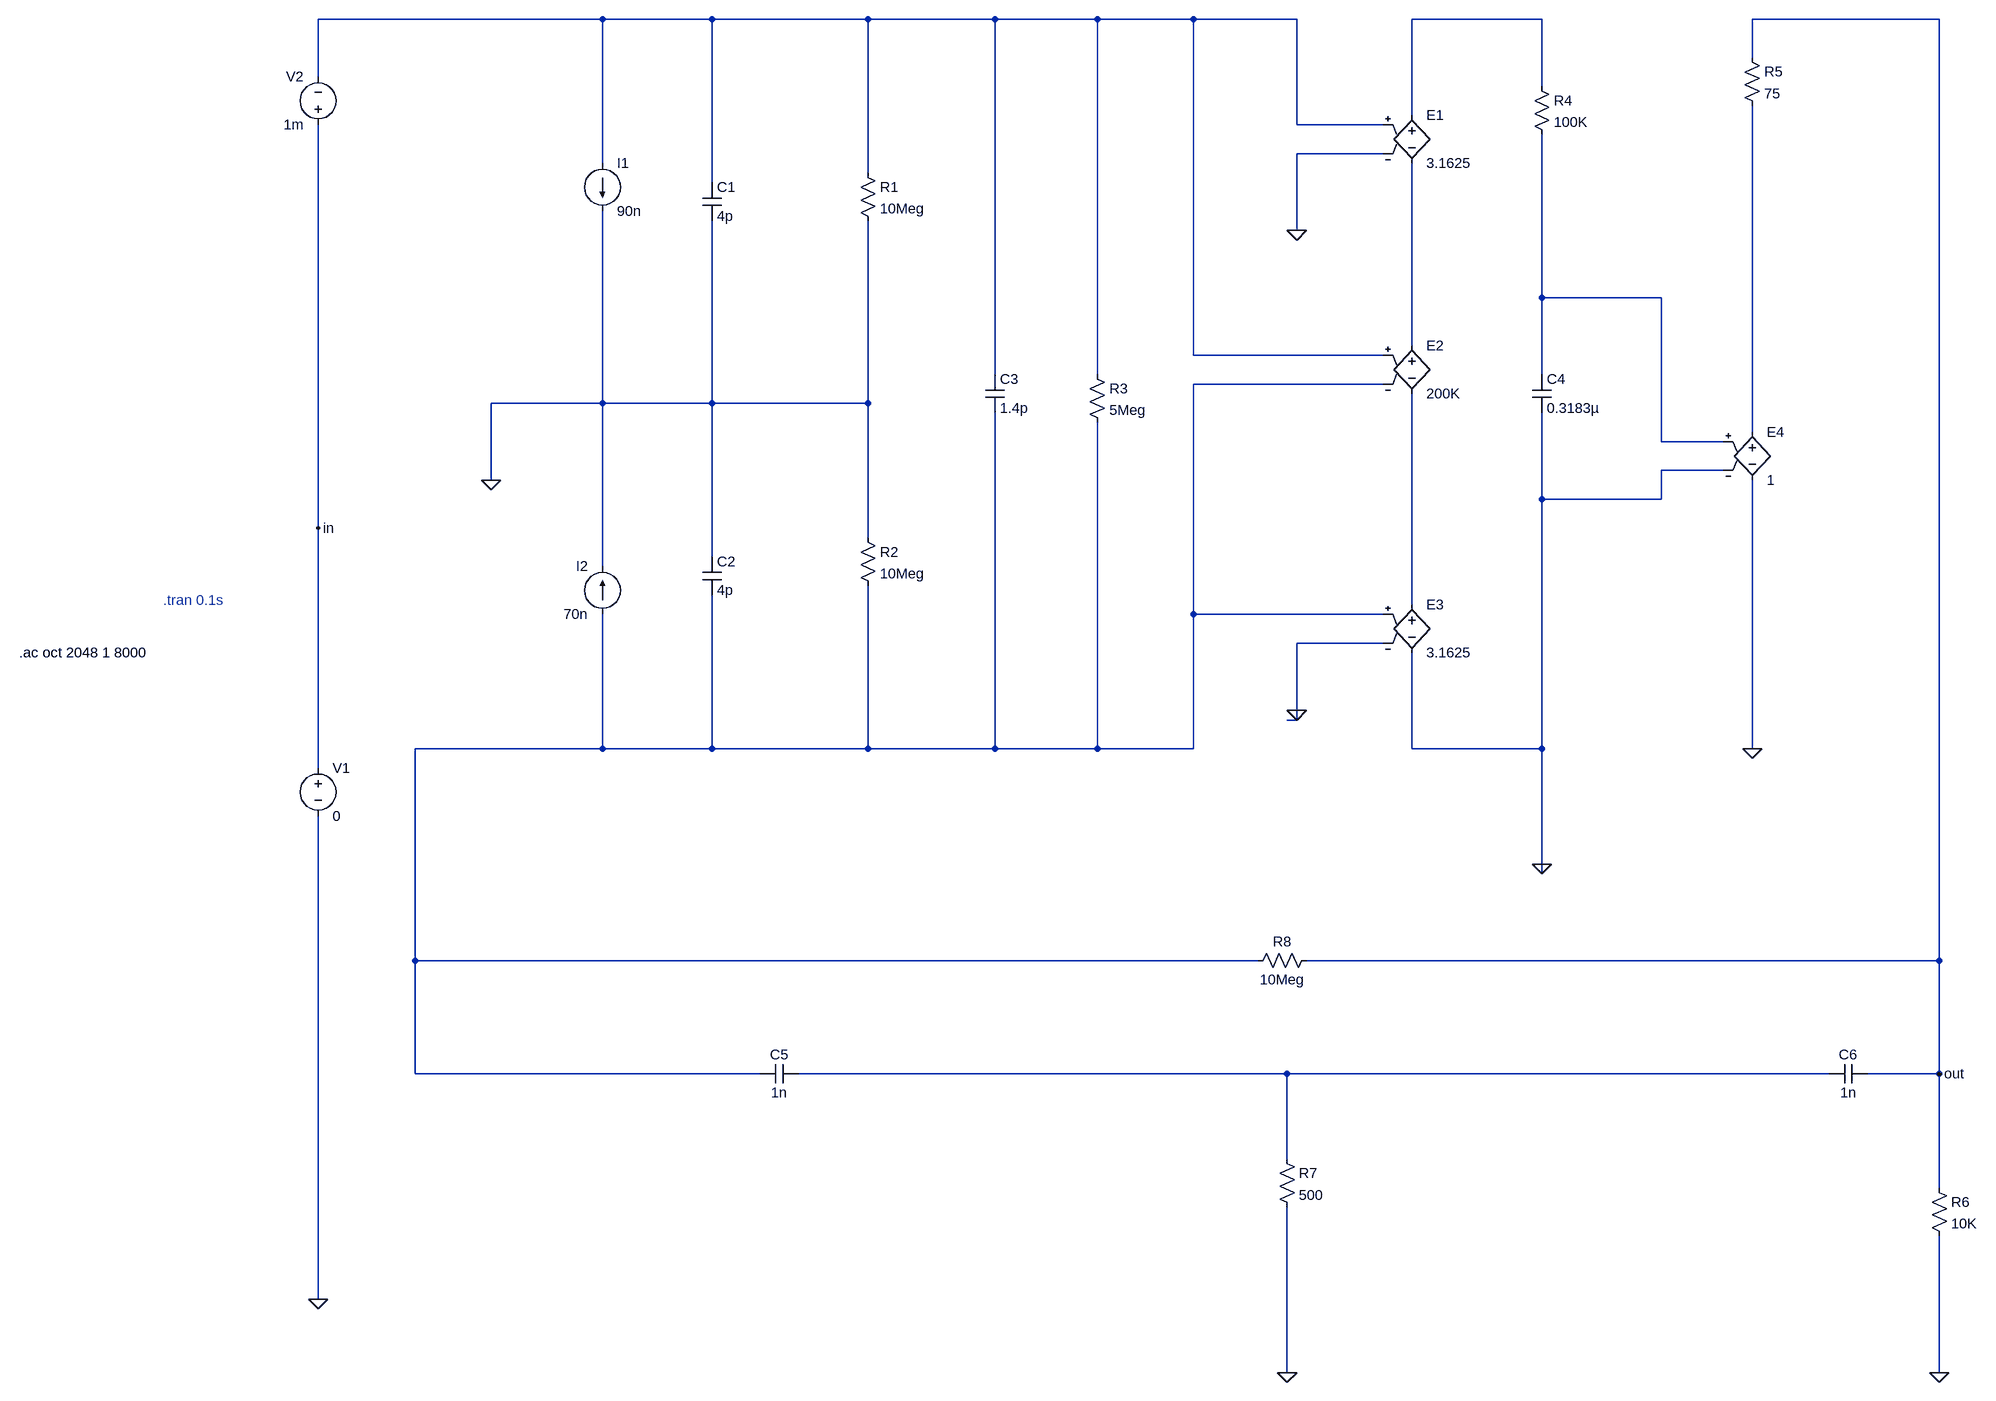
[diagram p0: schematic opamp_macromodel.asc]
opamp_macromodel.asc, the LTspice schematic file:
Version 4
SHEET 1 5460 1888
WIRE 880 -992 -64 -992
WIRE 1296 -992 880 -992
WIRE 1696 -992 1296 -992
WIRE 2016 -992 1696 -992
WIRE 2320 -992 2016 -992
WIRE 2480 -992 2320 -992
WIRE 2704 -992 2480 -992
WIRE 3296 -992 2896 -992
WIRE 5392 -992 3920 -992
WIRE 3920 -928 3920 -992
WIRE -64 -896 -64 -992
WIRE 3296 -880 3296 -992
WIRE 2896 -832 2896 -992
WIRE 2704 -816 2704 -992
WIRE 2848 -816 2704 -816
WIRE 2848 -768 2704 -768
WIRE 880 -752 880 -992
WIRE 1696 -736 1696 -992
WIRE 1296 -720 1296 -992
WIRE 2704 -640 2704 -768
WIRE 2704 -640 2688 -640
WIRE 3296 -528 3296 -800
WIRE 3760 -528 3296 -528
WIRE 2896 -448 2896 -752
WIRE 2480 -432 2480 -992
WIRE 2848 -432 2480 -432
WIRE 2016 -400 2016 -992
WIRE 2320 -400 2320 -992
WIRE 3296 -400 3296 -528
WIRE 2848 -384 2480 -384
WIRE 880 -352 880 -672
WIRE 880 -352 656 -352
WIRE 1296 -352 1296 -656
WIRE 1296 -352 880 -352
WIRE 1696 -352 1696 -656
WIRE 1696 -352 1296 -352
WIRE 3920 -304 3920 -848
WIRE 3760 -288 3760 -528
WIRE 3872 -288 3760 -288
WIRE 3872 -240 3760 -240
WIRE 656 -224 656 -352
WIRE 3296 -192 3296 -336
WIRE 3760 -192 3760 -240
WIRE 3760 -192 3296 -192
WIRE -64 -144 -64 -816
WIRE 1696 -128 1696 -352
WIRE 1296 -96 1296 -352
WIRE 880 -80 880 -352
WIRE 2896 -16 2896 -368
WIRE 2480 0 2480 -384
WIRE 2848 0 2480 0
WIRE 2848 48 2704 48
WIRE 2704 160 2704 48
WIRE 2704 176 2704 160
WIRE 2704 176 2688 176
WIRE 880 224 880 0
WIRE 880 224 368 224
WIRE 1296 224 1296 -32
WIRE 1296 224 880 224
WIRE 1696 224 1696 -48
WIRE 1696 224 1296 224
WIRE 2016 224 2016 -336
WIRE 2016 224 1696 224
WIRE 2320 224 2320 -320
WIRE 2320 224 2016 224
WIRE 2480 224 2480 0
WIRE 2480 224 2320 224
WIRE 2896 224 2896 64
WIRE 3296 224 3296 -192
WIRE 3296 224 2896 224
WIRE 3920 224 3920 -224
WIRE -64 256 -64 -144
WIRE 3296 416 3296 224
WIRE 3296 432 3296 416
WIRE 368 832 368 224
WIRE 2640 832 368 832
WIRE 5392 832 5392 -992
WIRE 5392 832 2720 832
WIRE 368 1264 368 832
WIRE 1376 1264 368 1264
WIRE 2688 1264 1440 1264
WIRE 4048 1264 2688 1264
WIRE 5392 1264 5392 832
WIRE 5392 1264 4112 1264
WIRE 2688 1456 2688 1264
WIRE 5392 1504 5392 1264
WIRE -64 1728 -64 336
WIRE 2688 1872 2688 1536
WIRE 5392 1872 5392 1584
FLAG -64 1728 0
FLAG 3296 416 0
FLAG 2688 1872 0
FLAG 5392 1872 0
FLAG 3920 224 0
FLAG 656 -224 0
FLAG 2704 -640 0
FLAG 2704 160 0
FLAG -64 -144 in
FLAG 5392 1264 out
SYMBOL /e 2896 -848 R0
SYMATTR InstName E1
SYMATTR Value 3.1625
SYMBOL /e 2896 -464 R0
SYMATTR InstName E2
SYMATTR Value 200K
SYMBOL /e 2896 -32 R0
SYMATTR InstName E3
SYMATTR Value 3.1625
SYMBOL /e 3920 -320 R0
SYMATTR InstName E4
SYMATTR Value 1
SYMBOL /voltage -64 240 R0
SYMATTR InstName V1
SYMATTR Value 0
SYMATTR SpiceLine Rser=1
SYMATTR Value2 AC 100m
SYMBOL /voltage -64 -800 R180
WINDOW 0 24 96 Left 2
WINDOW 3 24 16 Left 2
SYMATTR InstName V2
SYMATTR Value 1m
SYMBOL /current 880 -752 R0
SYMATTR InstName I1
SYMATTR Value 90n
SYMBOL /current 880 0 R180
WINDOW 0 24 80 Left 2
WINDOW 3 24 0 Left 2
SYMATTR InstName I2
SYMATTR Value 70n
SYMBOL /cap 1280 -720 R0
SYMATTR InstName C1
SYMATTR Value 4p
SYMBOL /cap 1280 -96 R0
SYMATTR InstName C2
SYMATTR Value 4p
SYMBOL /cap 2000 -400 R0
SYMATTR InstName C3
SYMATTR Value 1.4p
SYMBOL /cap 3280 -400 R0
SYMATTR InstName C4
SYMATTR Value 0.3183µ
SYMBOL /cap 1440 1248 R90
WINDOW 0 0 32 VBottom 2
WINDOW 3 32 32 VTop 2
SYMATTR InstName C5
SYMATTR Value 1n
SYMBOL /cap 4112 1248 R90
WINDOW 0 0 32 VBottom 2
WINDOW 3 32 32 VTop 2
SYMATTR InstName C6
SYMATTR Value 1n
SYMBOL /res 1680 -752 R0
SYMATTR InstName R1
SYMATTR Value 10Meg
SYMBOL /res 1680 -144 R0
SYMATTR InstName R2
SYMATTR Value 10Meg
SYMBOL /res 2304 -416 R0
SYMATTR InstName R3
SYMATTR Value 5Meg
SYMBOL /res 3280 -896 R0
SYMATTR InstName R4
SYMATTR Value 100K
SYMBOL /res 3904 -944 R0
SYMATTR InstName R5
SYMATTR Value 75
SYMBOL /res 5376 1488 R0
SYMATTR InstName R6
SYMATTR Value 10K
SYMBOL /res 2672 1440 R0
SYMATTR InstName R7
SYMATTR Value 500
SYMBOL /res 2736 816 R90
WINDOW 0 0 56 VBottom 2
WINDOW 3 32 56 VTop 2
SYMATTR InstName R8
SYMATTR Value 10Meg
TEXT -544 -24 Left 2 ;.tran 0.1s
TEXT -784 64 Left 2 !.ac oct 2048 1 8000

The netlist it stands for:
* opamp_macromodel.asc
E1 N002 N004 N001 0 3.1625
E2 N004 N007 N001 N005 200K
E3 N007 0 N005 0 3.1625
E4 N006 0 N003 0 1
V1 in 0 0 AC 100m Rser=1
V2 in N001 1m
I1 N001 0 90n
I2 N005 0 70n
C1 N001 0 4p
C2 0 N005 4p
C3 N001 N005 1.4p
C4 N003 0 0.3183µ
C5 N008 N005 1n
C6 out N008 1n
R1 N001 0 10Meg
R2 0 N005 10Meg
R3 N001 N005 5Meg
R4 N002 N003 100K
R5 out N006 75
R6 out 0 10K
R7 N008 0 500
R8 out N005 10Meg
* .tran 0.1s
.ac oct 2048 1 8000
.backanno
.end